# EAGLE design analog-out (EAGLE 9.6.2)
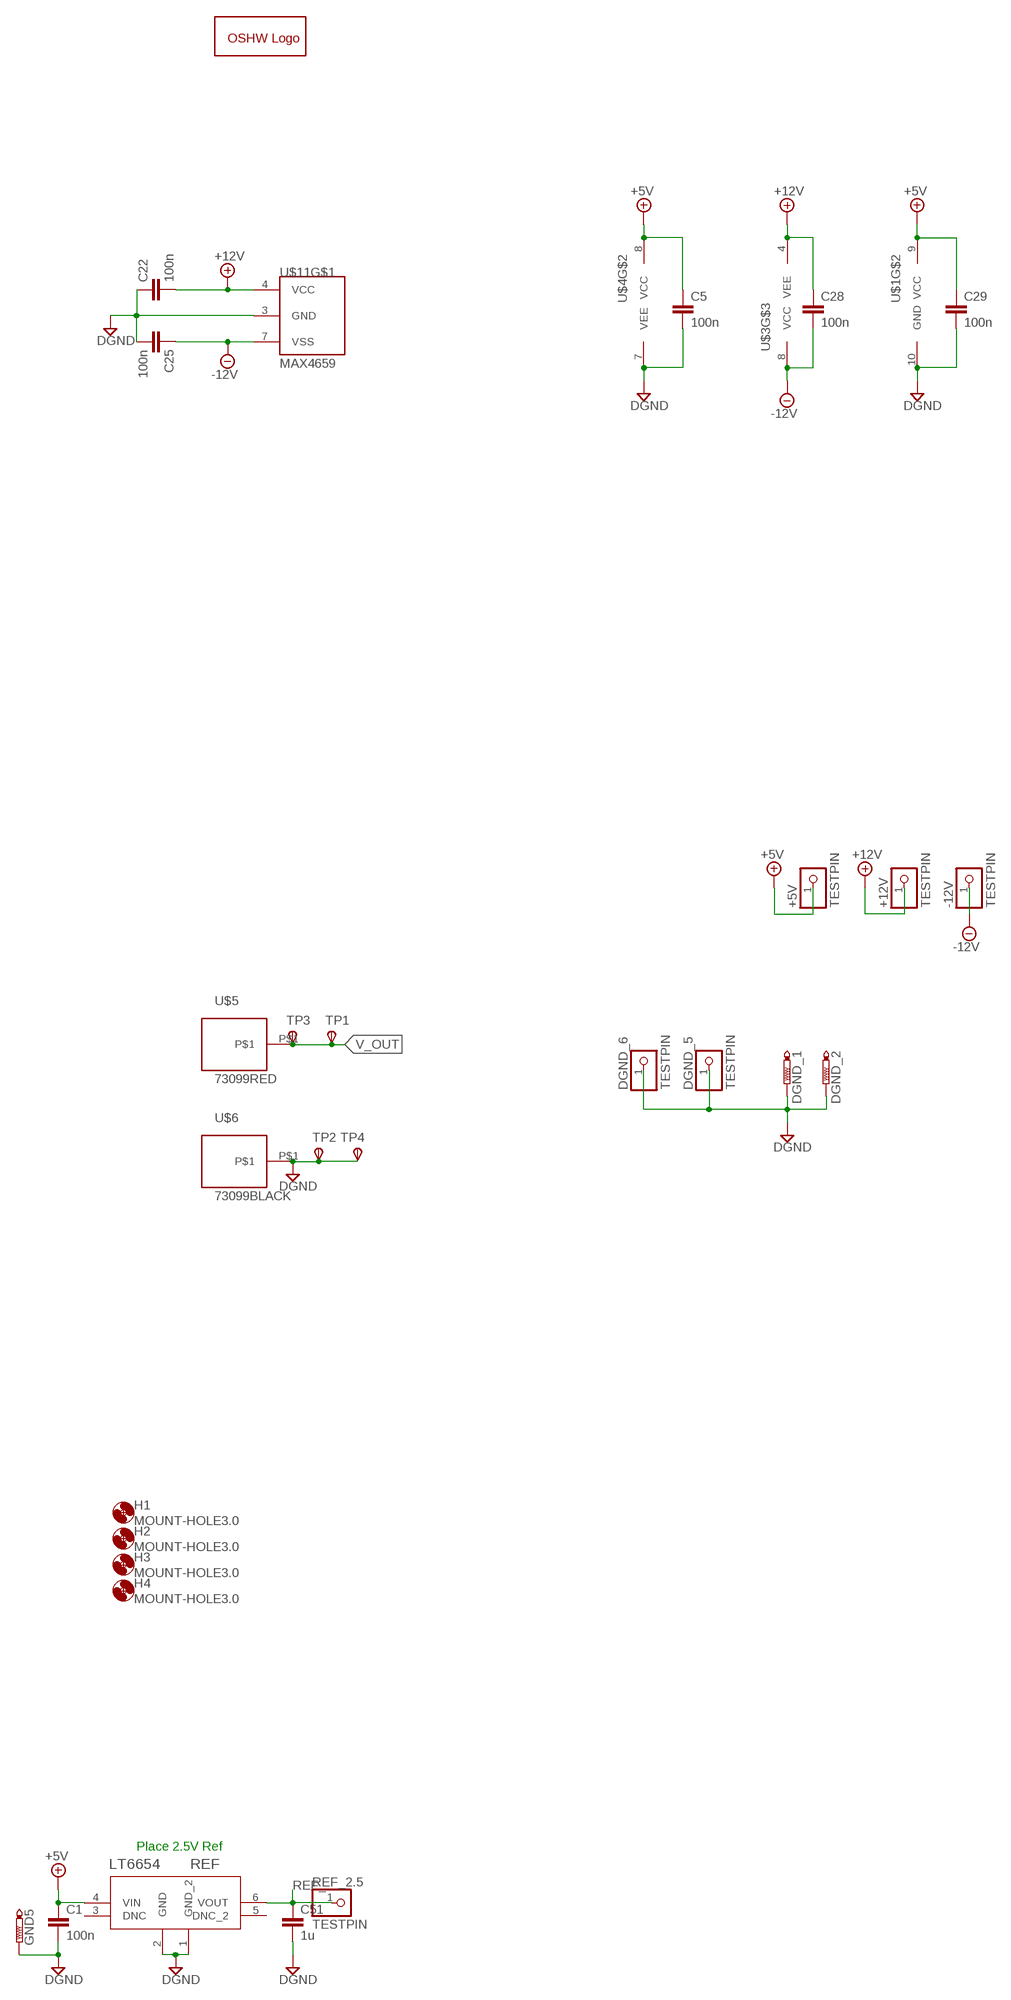
[diagram p0: schematic, sheet 1, part 1 of 2]
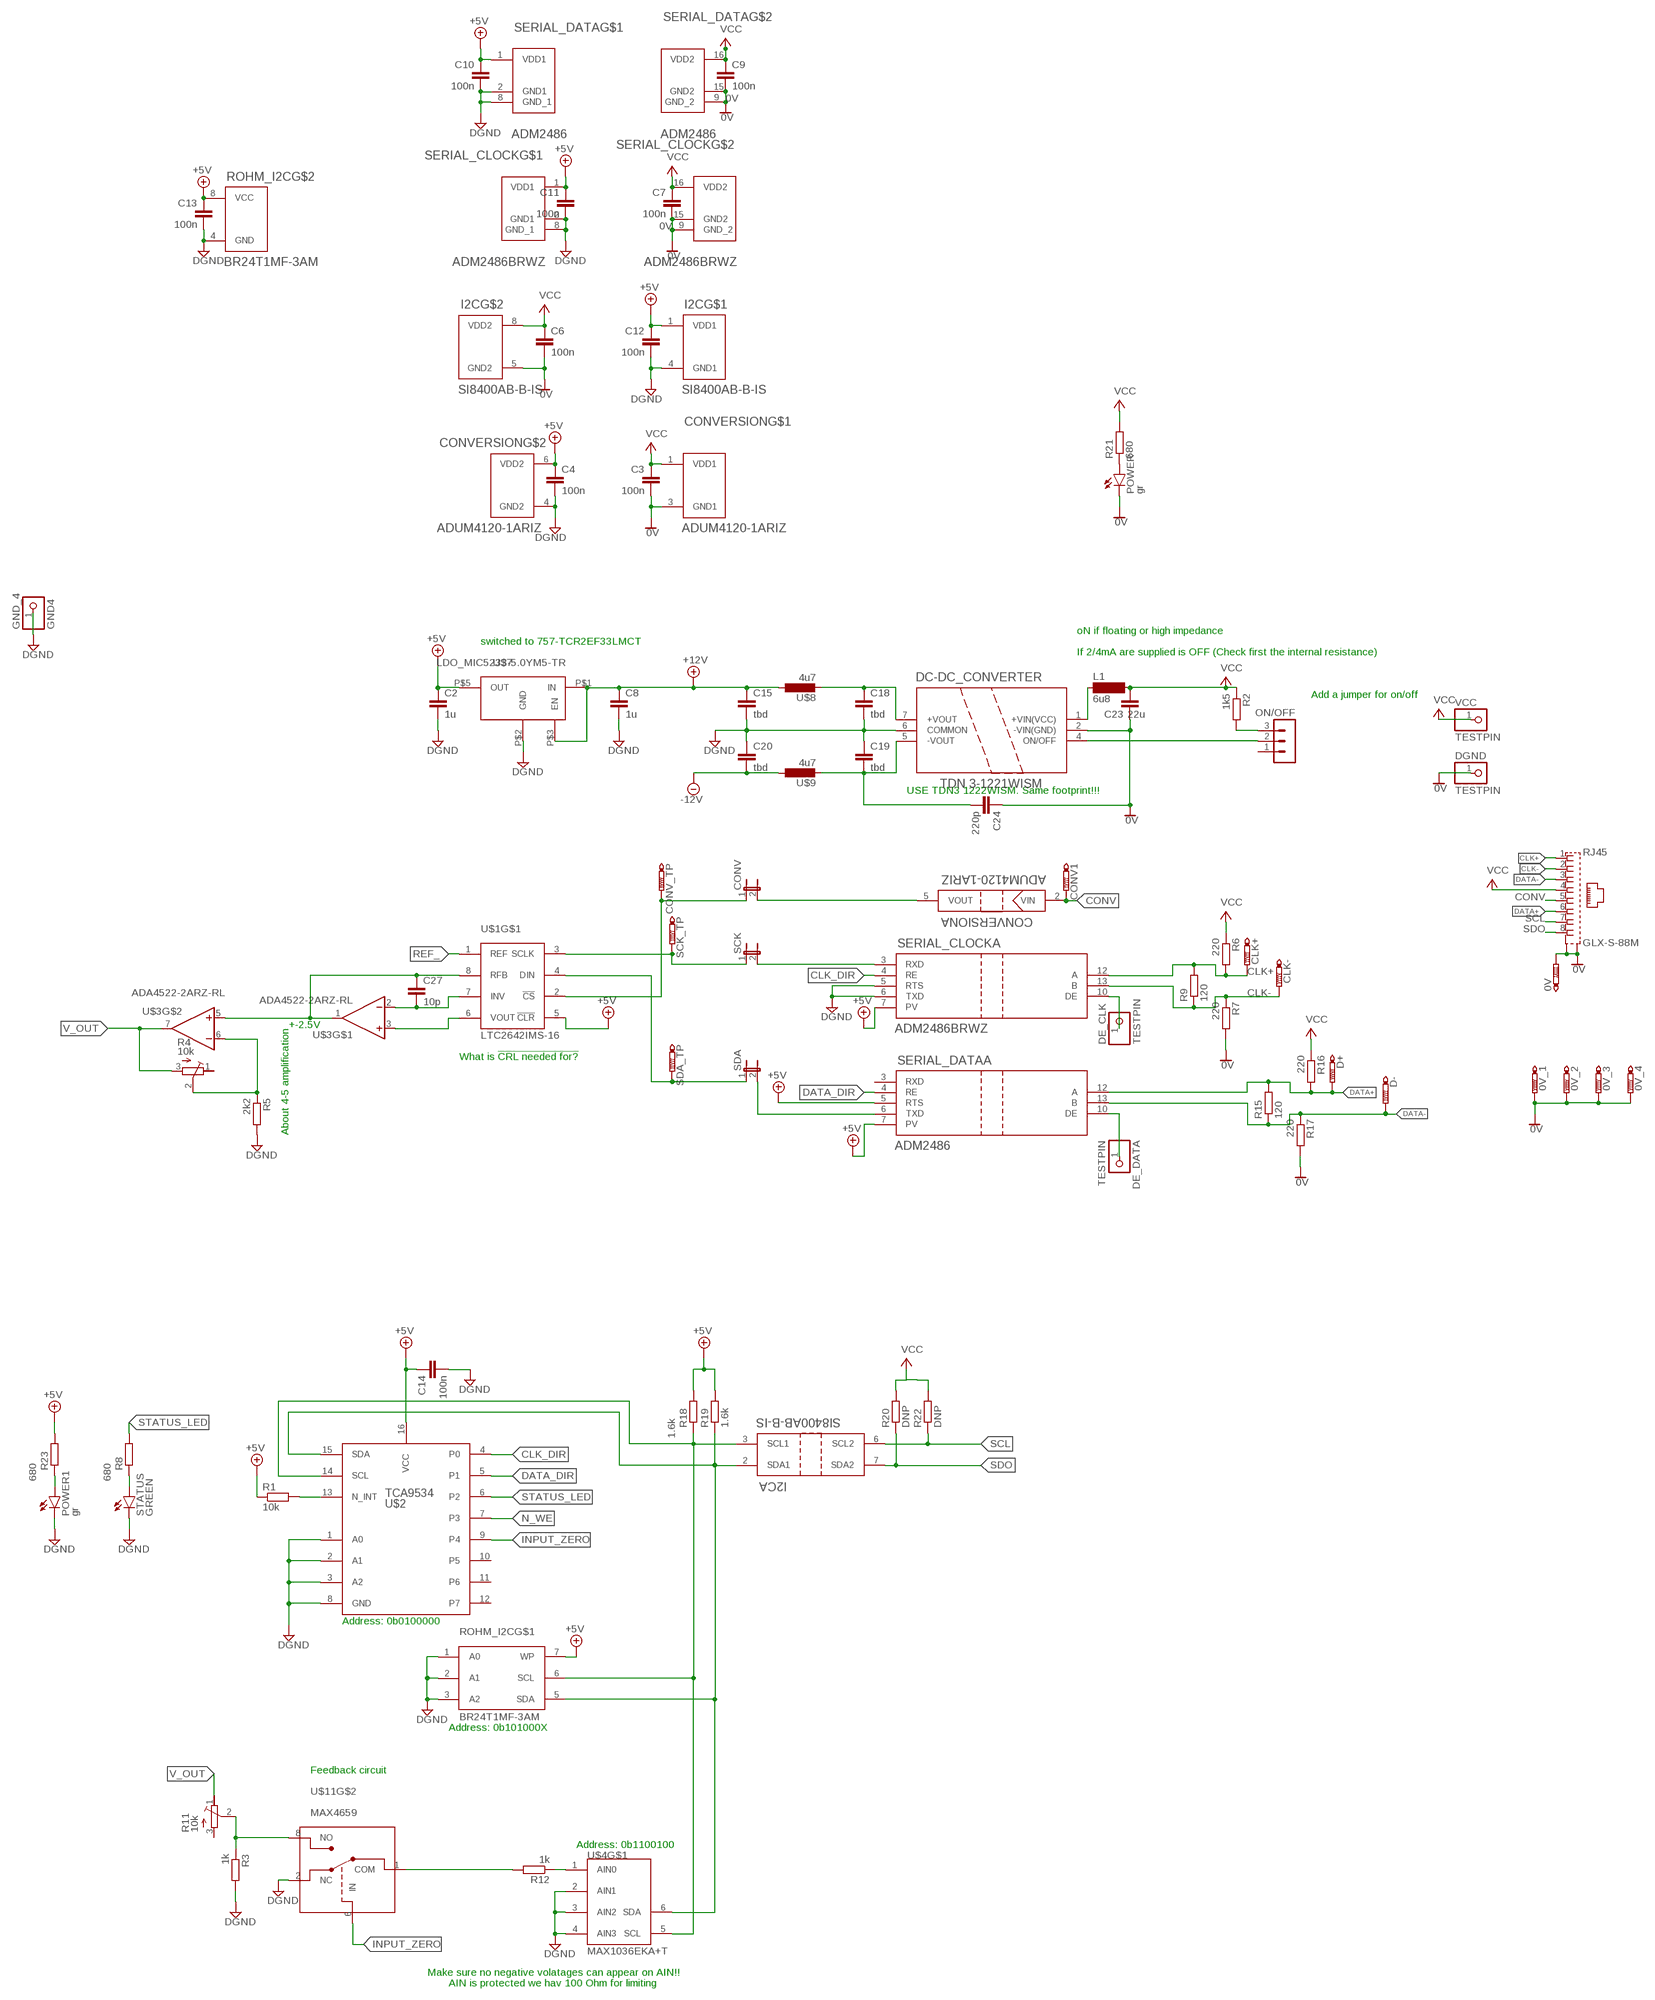
[diagram p1: schematic, sheet 1, part 2 of 2]

## Parts
0V  PTR1B1,27  [B1,27]
0V_1  PTR1B1,27  [B1,27]
0V_2  PTR1B1,27  [B1,27]
0V_3  PTR1B1,27  [B1,27]
0V_4  PTR1B1,27  [B1,27]
+5V  TESTPIN  [1X01]
+12V  TESTPIN  [1X01]
-12V  TESTPIN  [1X01]
C1  100n  C-EUC0805  [C0805]
C2  1u  C-EUC0805K  [C0805K]
C3  100n  C-EUC0805K  [C0805K]
C4  100n  C-EUC0805K  [C0805K]
C5  100n  C-EUC0805  [C0805]
C6  100n  C-EUC0805K  [C0805K]
C7  100n  C-EUC0805K  [C0805K]
C8  1u  C-EUC0805K  [C0805K]
C9  100n  C-EUC0805K  [C0805K]
C10  100n  C-EUC0805K  [C0805K]
C11  100n  C-EUC0805K  [C0805K]
C12  100n  C-EUC0805K  [C0805K]
C13  100n  C-EUC0805K  [C0805K]
C14  100n  C-EUC0805K  [C0805K]
C15  tbd  C-EUC0805K  [C0805K]
C18  tbd  C-EUC0805K  [C0805K]
C19  tbd  C-EUC0805K  [C0805K]
C20  tbd  C-EUC0805K  [C0805K]
C22  100n  C-EUC0805  [C0805]
C23  22u  C-EUC1206  [C1206]
C24  220p  C-EUC1808  [C1808]
C25  100n  C-EUC0805  [C0805]
C27  10p  C-EUC0805  [C0805]
C28  100n  C-EUC0805  [C0805]
C29  100n  C-EUC0805  [C0805]
C51  1u  C-EUC0805  [C0805]
CLK+  PTR1B1,27  [B1,27]
CLK-  PTR1B1,27  [B1,27]
CONV  JP1E  [JP1]
CONV1  PTR1B1,27  [B1,27]
CONV_TP  PTR1B1,27  [B1,27]
CONVERSION  ADUM4120-1ARIZ  [RI_6_1_ADI]
D+  PTR1B1,27  [B1,27]
D-  PTR1B1,27  [B1,27]
DC-DC_CONVERTER  TDN 3-1221WISM  TDN_3-1211WI  [TDN3_TRP]
DE_CLK  TESTPIN  [1X01]
DE_DATA  TESTPIN  [1X01]
DGND  TESTPIN  [1X01]
DGND_1  PTR1B1,27  [B1,27]
DGND_2  PTR1B1,27  [B1,27]
DGND_5  TESTPIN  [1X01]
DGND_6  TESTPIN  [1X01]
GND5  PTR1B1,27  [B1,27]
GND_4  GND4  TESTPIN  [1X01]
GOLD_ORB_SM1  OSHWLOGOLOGO8MM  [OSHW_8MM]
H1  MOUNT-HOLE3.0  [3,0]
H2  MOUNT-HOLE3.0  [3,0]
H3  MOUNT-HOLE3.0  [3,0]
H4  MOUNT-HOLE3.0  [3,0]
I2C  SI8400AB-B-IS  ADUM1251WARZ  [R_8_ADI]
L1  6u8  SM-NE29  [SM-NE29]
ON/OFF  MA03-1  [MA03-1]
POWER  gr  LEDSML0805  [SML0805]
POWER1  gr  LEDSML0805  [SML0805]
R1  10k  R-EU_R0805  [R0805]
R2  1k5  R-EU_R0805  [R0805]
R3  1k  R-EU_R0805  [R0805]
R4  10k  R-TRIMMT93YA  [RTRIMT93YA]
R5  2k2  R-EU_R0805  [R0805]
R6  220  R-EU_R0805  [R0805]
R7  220  R-EU_R0805  [R0805]
R8  680  R-EU_R0805  [R0805]
R9  120  R-EU_R0805  [R0805]
R11  10k  R-TRIMMT93YA  [RTRIMT93YA]
R12  1k  R-EU_R0805  [R0805]
R15  120  R-EU_R0805  [R0805]
R16  220  R-EU_R0805  [R0805]
R17  220  R-EU_R0805  [R0805]
R18  1.6k  R-EU_R0805  [R0805]
R19  1.6k  R-EU_R0805  [R0805]
R20  DNP  R-EU_R0805  [R0805]
R21  680  R-EU_R0805  [R0805]
R22  DNP  R-EU_R0805  [R0805]
R23  680  R-EU_R0805  [R0805]
REF  LT6654  LT6654AIS6-2.048TRMPBF  [S_6_ADI]
REF_2.5  TESTPIN  [1X01]
RJ45  GLX-S-88M  [GLX-S-88M]
ROHM_I2C  BR24T1MF-3AM  [BR24T1MFJ-3AM]
SCK  JP1E  [JP1]
SCK_TP  PTR1B1,27  [B1,27]
SDA  JP1E  [JP1]
SDA_TP  PTR1B1,27  [B1,27]
SERIAL_CLOCK  ADM2486BRWZ  ADM2486BRWZ-REEL  [RW_16_ADI]
SERIAL_DATA  ADM2486  ADM2486BRWZ-REEL  [RW_16_ADI]
STATUS  GREEN  LEDCHIPLED_0805  [CHIPLED_0805]
TP1  TPSTP20SQ  [TP20SQ]
TP2  TPSTP20SQ  [TP20SQ]
TP3  TPSTP20SQ  [TP20SQ]
TP4  TPSTP20SQ  [TP20SQ]
U$1  LTC2642IMS-16  [MSOP10]
U$2  TCA9534  [TSSOP16L]
U$3  ADA4522-2ARZ-RL  [MSOP8]
U$4  MAX1036EKA+T  [SOT23-8L]
U$5  73099RED  [4MM_BANANA]
U$6  73099BLACK  [4MM_BANANA]
U$7  LDO_MIC5233-5.0YM5-TR  [SOT23-5]
U$8  4u7  NRS5010T4R7MMGF  [L5038P]
U$9  4u7  NRS5010T4R7MMGF  [L5038P]
U$11  MAX4659  [UMAX8]
VCC  TESTPIN  [1X01]

## Nets
0V: 0V.TP 0V_1.TP 0V_2.TP 0V_3.TP 0V_4.TP C3.2 C6.2 C7.2 C9.2 C23.1 C24.1 CONVERSION.3(GND1) DC-DC_CONVERTER.2(-VIN(GND)) DGND.1 I2C.5(GND2) POWER.C R7.2 R17.2 RJ45.S1 RJ45.S2 SERIAL_CLOCK.9(GND_2) SERIAL_CLOCK.15(GND2) SERIAL_DATA.9(GND_2) SERIAL_DATA.15(GND2)
+5V: +5V.1 C1.1 C2.1 C4.1 C5.1 C10.1 C11.1 C12.1 C13.1 C14.1 C29.1 CONVERSION.6(VDD2) I2C.1(VDD1) R1.1 R18.2 R19.2 R23.2 REF.4(VIN) ROHM_I2C.7(WP) ROHM_I2C.8(VCC) SERIAL_CLOCK.1(VDD1) SERIAL_CLOCK.7(A:PV) SERIAL_DATA.1(VDD1) SERIAL_DATA.5(A:RTS) SERIAL_DATA.7(A:PV) U$1.5(!CLR) U$1.9(VCC) U$2.16(VCC) U$4.8(VCC) U$7.P$5(OUT)
+12V: +12V.1 C8.1 C15.1 C22.2 C28.1 U$3.4(VEE) U$7.P$1(IN) U$7.P$3(EN) U$8.1 U$11.4(VCC)
-12V: -12V.1 C20.2 C25.1 C28.2 U$3.8(VCC) U$9.1 U$11.7(VSS)
CLK+: CLK+.TP R6.2 R9.2 RJ45.1 SERIAL_CLOCK.12(A:A)
CLK-: CLK-.TP R7.1 R9.1 RJ45.2 SERIAL_CLOCK.13(A:B)
CLK_DIR: SERIAL_CLOCK.4(A:RE) U$2.4(P0)
CONV: CONV1.TP CONVERSION.2(A:VIN) RJ45.5
CONV_ADC: CONV.1 CONV_TP.TP U$1.2(!CS)
DATA+: D+.TP R15.2 R16.2 RJ45.6 SERIAL_DATA.12(A:A)
DATA-: D-.TP R15.1 R17.1 RJ45.3 SERIAL_DATA.13(A:B)
DATA_DIR: SERIAL_DATA.4(A:RE) U$2.5(P1)
DGND: C1.2 C2.2 C4.2 C5.2 C8.2 C10.2 C11.2 C12.2 C13.2 C14.2 C15.2 C18.2 C19.1 C20.1 C22.1 C25.2 C29.2 C51.2 CONVERSION.4(GND2) DC-DC_CONVERTER.6(COMMON) DGND_1.TP DGND_2.TP DGND_5.1 DGND_6.1 GND5.TP GND_4.1 I2C.4(GND1) POWER1.C R3.2 R5.2 REF.1(GND_2) REF.2(GND) ROHM_I2C.1(A0) ROHM_I2C.2(A1) ROHM_I2C.3(A2) ROHM_I2C.4(GND) SERIAL_CLOCK.2(GND1) SERIAL_CLOCK.5(A:RTS) SERIAL_CLOCK.6(A:TXD) SERIAL_CLOCK.8(GND_1) SERIAL_DATA.2(GND1) SERIAL_DATA.8(GND_1) STATUS.C TP2.TP(PP) TP4.TP(PP) U$1.10(GND) U$2.1(A0) U$2.2(A1) U$2.3(A2) U$2.8(GND) U$4.2(AIN1) U$4.3(AIN2) U$4.4(AIN3) U$4.7(VEE) U$6.P$1 U$7.P$2(GND) U$11.2(NC) U$11.3(GND)
INPUT_ZERO: U$2.9(P4) U$11.6(IN)
N$1: C27.2 U$1.7(INV) U$3.2(-IN)
N$2: R1.2 U$2.13(N_INT)
N$3: DE_CLK.1 SERIAL_CLOCK.10(A:DE)
N$4: SDA.2 SERIAL_DATA.6(A:TXD)
N$5: U$1.6(VOUT) U$3.3(+IN)
N$6: C19.2 C24.2 DC-DC_CONVERTER.5(-VOUT) U$9.2
N$7: DE_DATA.1 SERIAL_DATA.10(A:DE)
N$9: C27.1 U$1.8(RFB) U$3.1(OUT) U$3.5(+IN)
N$10: DC-DC_CONVERTER.1(+VIN(VCC)) L1.1
N$11: ON/OFF.3 R2.2
N$12: DC-DC_CONVERTER.4(ON/OFF) ON/OFF.2
N$13: R12.1 U$4.1(AIN0)
N$14: I2C.2(A:SDA1) R19.1 ROHM_I2C.5(SDA) U$2.15(SDA) U$4.6(SDA)
N$15: R4.2(S) R5.1 U$3.6(-IN)
N$16: R3.1 R11.2(S) U$11.8(NO)
N$17: I2C.3(A:SCL1) R18.1 ROHM_I2C.6(SCL) U$2.14(SCL) U$4.5(SCL)
N$18: R12.2 U$11.1(COM)
N$19: C18.1 DC-DC_CONVERTER.7(+VOUT) U$8.2
N$22: R8.1 STATUS.A
N$24: CONV.2 CONVERSION.5(A:VOUT)
N$26: SCK.1 SCK_TP.TP U$1.3(SCLK)
N$27: POWER1.A R23.1
N$53: POWER.A R21.1
N_WE: U$2.7(P3)
REF_: C51.1 REF.6(VOUT) REF_2.5.1 U$1.1(REF)
SCK_ADC: SCK.2 SERIAL_CLOCK.3(A:RXD)
SCL: I2C.6(A:SCL2) R22.1 RJ45.7
SDO: I2C.7(A:SDA2) R20.1 RJ45.8
SDO_ADC: SDA.1 SDA_TP.TP U$1.4(DIN)
STATUS_LED: R8.2 U$2.6(P2)
V+: C3.1 C6.1 C7.1 C9.1 C23.2 CONVERSION.1(VDD1) I2C.8(VDD2) L1.2 R2.1 R6.1 R16.1 R20.2 R21.2 R22.2 RJ45.4 SERIAL_CLOCK.16(VDD2) SERIAL_DATA.16(VDD2) VCC.1 ; supply symbol labelled VCC
V_OUT: R4.3(A) R11.1(E) TP1.TP(PP) TP3.TP(PP) U$3.7(OUT) U$5.P$1
Unconnected: ON/OFF.1 R4.1(E) R11.3(A) REF.3(DNC) REF.5(DNC_2) SERIAL_DATA.3(A:RXD) U$2.10(P5) U$2.11(P6) U$2.12(P7)

## Notes on the sheet
- oN if floating or high impedance
- switched to 757-TCR2EF33LMCT
- If 2/4mA are supplied is OFF (Check first the internal resistance)
- Add a jumper for on/off
- USE TDN3 1222WISM. Same footprint!!!
- +-2.5V
- What is !CRL needed for?
- About 4-5 amplification
- Place 2.5V Ref
- Address: 0b0100000
- Address: 0b101000X
- Feedback circuit
- Address: 0b1100100
- Make sure no negative volatages can appear on AIN!!
- AIN is protected we hav 100 Ohm for limiting

## Library data of the parts
0V 0V_1-0V_4 CLK+ CLK- CONV1 CONV_TP D+ D- DGND_1 DGND_2 GND5 SCK_TP SDA_TP = testpad:PTR1: TEST PIN
+5V +12V -12V DE_CLK DE_DATA DGND DGND_5 DGND_6 GND_4 REF_2.5 VCC = myLib:TESTPIN
C1 C5 C22 C25 C27-C29 = rcl:C-EU: CAPACITOR, European symbol; DIGIKEY: 478-7962-1-ND; MOUSER: 81-GRM21BZ71E106KE5L; SPICEPREFIX: C
C2-C4 C6-C15 C18-C20 = rcl:C-EU: CAPACITOR, European symbol; DIGIKEY: 478-7962-1-ND; SPICEPREFIX: C
C23 = rcl:C-EU: CAPACITOR, European symbol; DIGIKEY: 399-17625-1-ND; SPICEPREFIX: C
C24 = rcl:C-EU: CAPACITOR, European symbol; DIGIKEY: 478-10448-2-ND; SPICEPREFIX: C
C51 = rcl:C-EU: CAPACITOR, European symbol; DIGIKEY: 1276-6471-1-ND; MOUSER: 81-GRM21BZ71E106KE5L; SPICEPREFIX: C
CONV SCK SDA = jumper:JP1E: JUMPER
CONVERSION = ADUM4120:ADUM4120-1ARIZ; BUILT_BY: Analog Devices Inc.; DIGIKEY: ADUM4120-1ARIZ-ND; MANUFACTURER_PART_NUMBER: ADUM4120-1ARIZ; SOURCELIBRARY: Analog_2017-10-24; VENDOR: Analog Devices Inc
DC-DC_CONVERTER = TDN3-1221WISM:TDN_3-1211WI; BUILT_BY: EMA_Justin; COPYRIGHT: Copyright (C) 2018 Accelerated Designs. All rights reserved; DIGIKEY: TDN3-1222WISM-ND; MOUSER: 495-TDN3-1222WISM; SOURCELIBRARY: Traco_Power_2020-05-19; VENDOR: Traco Power
GOLD_ORB_SM1 = oshw:OSHWLOGO: The OSHW logo for PCB layout
H1-H4 = holes:MOUNT-HOLE: MOUNTING HOLE with drill center marker
I2C = ADUM1251WARZ:ADUM1251WARZ; BUILT_BY: EMA_UL_Team; COPYRIGHT: Copyright (C) 2018 Accelerated Designs. All rights reserved; MANUFACTURER_PART_NUMBER: ADUM1251WARZ; MOUSER: 634-SI8400AB-B-IS; SOURCELIBRARY: Analog_2019-03-08; VENDOR: Analog Devices Inc
L1 = inductor-neosid:SM-NE29: INDUCTOR SMD chip inductor; DIGIKEY: 1951-1045-ND; OC_FARNELL: unknown; OC_NEWARK: unknown
ON/OFF = con-lstb:MA03-1: PIN HEADER; DIGIKEY: 732-5316-ND; OC_FARNELL: unknown; OC_NEWARK: unknown
POWER POWER1 STATUS = led:LED: LED OSRAM: - CHIPLED LG R971, LG N971, LY N971, LG Q971, LY Q971, LO R971, LY R971 LH N974, LH R974 LS Q976, LO Q976, LY Q976 LO Q996 - Hyper CHIPLED LW Q18S LB Q993, LB Q99A, LB R99A - SideLED LS A670, LO A670, LY A670, LG A670, LP A670 LB A673, LV A673, LT A673, LW A673 LH A674 LY A675 LS A676, LA A676, LO A676, LY A676, LW A676 LS A679, LY A679, LG A679 - Hyper Micro SIDELED® LS Y876, LA Y876, LO Y876, LY Y876 LT Y87S - SmartLED LW L88C, LW L88S LB L89C, LB L89S, LG L890 LS L89K, LO L89K, LY L89K LS L896, LA L896, LO L896, LY L896 - TOPLED LS T670, LO T670, LY T670, LG T670, LP T670 LSG T670, LSP T670, LSY T670, LOP T670, LYG T670 LG T671, LOG T671, LSG T671 LB T673, LV T673, LT T673, LW T673 LH T674 LS T676, LA T676, LO T676, LY T676, LB T676, LH T676, LSB T676, LW T676 LB T67C, LV T67C, LT T67C, LS T67K, LO T67K, LY T67K, LW E67C LS E67B, LA E67B, LO E67B, LY E67B, LB E67C, LV E67C, LT E67C LW T67C LS T679, LY T679, LG T679 LS T770, LO T770, LY T770, LG T770, LP T770 LB T773, LV T773, LT T773, LW T773 LH T774 LS E675, LA E675, LY E675, LS T675 LS T776, LA T776, LO T776, LY T776, LB T776 LHGB T686 LT T68C, LB T68C - Hyper Mini TOPLED® LB M676 - Mini TOPLED Santana® LG M470 LS M47K, LO M47K, LY M47K Source: http://www.osram.convergy.de LUXEON: - LUMILED® LXK2-PW12-R00, LXK2-PW12-S00, LXK2-PW14-U00, LXK2-PW14-V00 LXK2-PM12-R00, LXK2-PM12-S00, LXK2-PM14-U00 LXK2-PE12-Q00, LXK2-PE12-R00, LXK2-PE12-S00, LXK2-PE14-T00, LXK2-PE14-U00 LXK2-PB12-K00, LXK2-PB12-L00, LXK2-PB12-M00, LXK2-PB14-N00, LXK2-PB14-P00, LXK2-PB14-Q00 LXK2-PR12-L00, LXK2-PR12-M00, LXK2-PR14-Q00, LXK2-PR14-R00 LXK2-PD12-Q00, LXK2-PD12-R00, LXK2-PD12-S00 LXK2-PH12-R00, LXK2-PH12-S00 LXK2-PL12-P00, LXK2-PL12-Q00, LXK2-PL12-R00 Source: www.luxeon.com KINGBRIGHT: KA-3528ASYC Source: www.kingbright.com; DIGIKEY: LTST-C170GKT
R1 = rcl:R-EU_: RESISTOR, European symbol; DIGIKEY: P10KDATR-ND; MOUSER: 652-CR0805JW-561ELF; SPICEPREFIX: R
R2 = rcl:R-EU_: RESISTOR, European symbol; DIGIKEY: P1.5KDATR-ND; SPICEPREFIX: R
R3 R5 R9 R15 = rcl:R-EU_: RESISTOR, European symbol; DIGIKEY: Y1629-120DTR-ND; SPICEPREFIX: R
R4 R11 = rcl:R-TRIMM: Trimm resistor; SPICEMODEL: X; SPICEPREFIXL: POT
R6 R7 R16 R17 = rcl:R-EU_: RESISTOR, European symbol; DIGIKEY: Y1624195R000Q9R-ND; SPICEPREFIX: R
R8 R12 R18-R20 R22 R23 = resistor:R-EU_: RESISTOR, European symbol
R21 = rcl:R-EU_: RESISTOR, European symbol; DIGIKEY: A129747TR-ND; MOUSER: 652-CR0805JW-561ELF; SPICEPREFIX: R
REF = LT6654AIS6-2.048:LT6654AIS6-2.048TRMPBF; BUILT_BY: EMA_Jessica; COPYRIGHT: Copyright (C) 2016 Accelerated Designs. All rights reserved; DIGIKEY: 505-LT6654AIS6-2.5#TRMPBFTR-ND; SOURCELIBRARY: Analog_Devices_2018-09-28; VENDOR: Analog Devices Inc
RJ45 = con-kycon:GLX-S-88M: Mod. Jack, Right Angle, 8 posiotion, 8 contatcs RJ45 Source: GLX-S-88M.pdf; DIGIKEY: 2092-GLX-S-88M-ND; OC_FARNELL: unknown; OC_NEWARK: unknown
ROHM_I2C = BR24T1MFJ-3AM:BR24T1MF-3AM; DIGIKEY: BR24T1MF-3AME2TR-ND
SERIAL_CLOCK SERIAL_DATA = ADM2486:ADM2486BRWZ-REEL; BUILT_BY: EMA_UL_Team; DIGIKEY: ADM2486BRWZ-REELTR-ND; MANUFACTURER_PART_NUMBER: ADM2486BRWZ-REEL; SOURCELIBRARY: Analog_2012-01-01_7; VENDOR: Analog Devices Inc
TP1-TP4 = CONN_smd:TPS: TEST PIN
U$1 = my:LTC2642IMS-16; DIGIKEY: LTC2642IMS-16#TRPBFCT-ND
U$2 = parts:TCA9534; DIGIKEY: 296-40574-2-ND
U$3 = my:ADA4522-2ARZ-RL; DIGIKEY: 505-ADA4522-2ARZ-RLCT-ND
U$4 = my:MAX1036EKA+T; DIGIKEY: MAX1036EKA+TTR-ND
U$5 U$6 = my:73099
U$7 = my:LDO_; MOUSER: 998-MIC5233-5.0YM5TR
U$8 U$9 = my:NRS5010T4R7MMGF
U$11 = my:MAX4659; MOUSER: 700-MAX4659EUA

## Net classes
3 FPGA: clearance 0.152 mm to class 0, clearance 7.112 mm to class 1, clearance 3.785 mm to class 2, clearance 0.152 mm

## Board
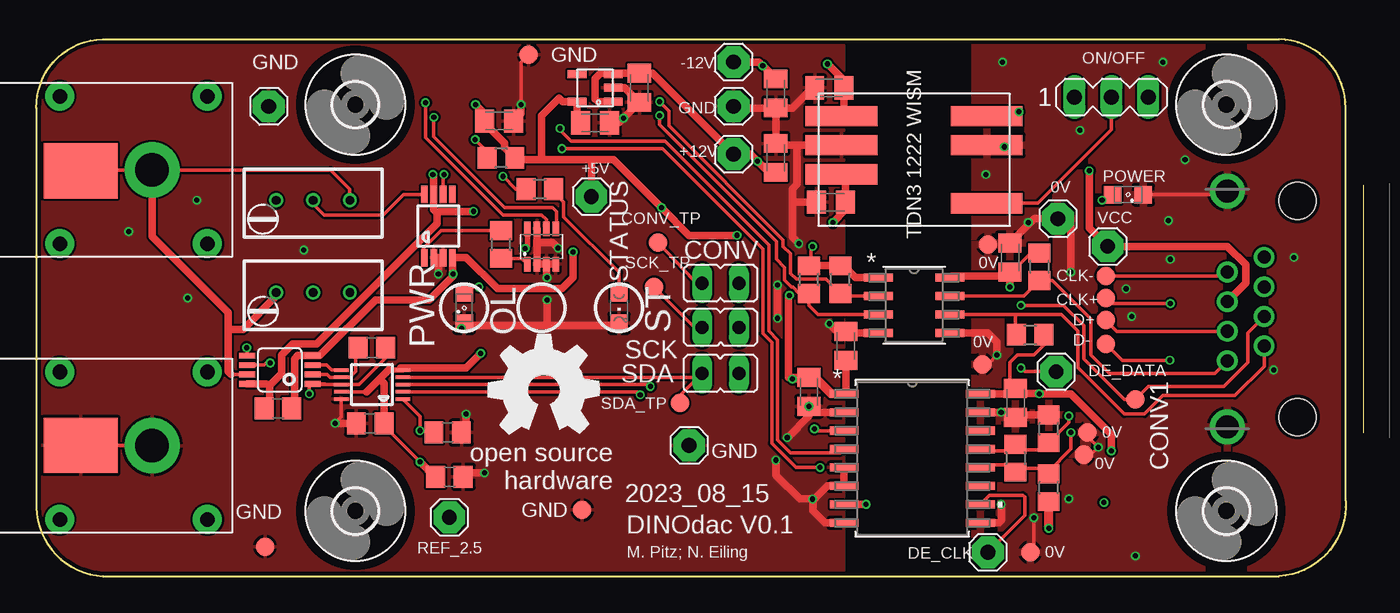
[diagram p2: board, top side]
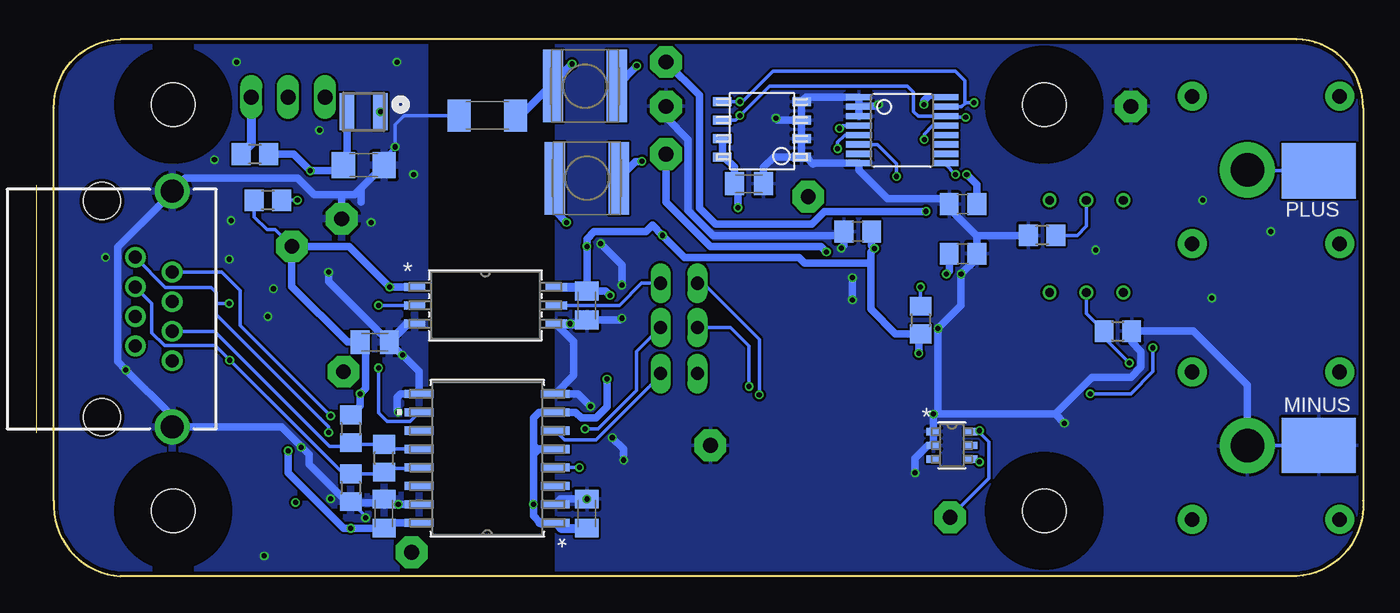
[diagram p3: board, bottom side, seen from below]

Size 90.19 x 37 mm. Coordinates in mm from the lower left corner, seen from the top.
Outline: 0.01,32.26 arc-90 4.58,37 85.61,37 arc-90 90.18,32.26 90.18,5.21 arc-90 85.61,0 4.58,0 arc-90 0.01,5.21 0.01,32.26
Copper layers (1*16): Top 0.018mm / dielectric 1.55mm / Bottom 0.018mm
Design rules "eC_2Layer_PClass6_BaseCopperO18_eCDefault": minimum track width 0.15mm, minimum drill 0.35mm, track to track 0.15mm, track to pad 0.15mm, pad to pad 0.15mm, via to via 0.15mm, smd to smd 0mil, copper to edge 0.25mm, drill to drill 0.35mm, minimum pad ring 0.175mm, minimum via ring 0.125mm, stop-mask expansion 0mil, vias tented up to drill 0.45mm, thermal gap 0.2mm

### Footprints (pad centres in the part's own frame; a part is rotated, then mirrored left to right if it is on the bottom)
B1,27 = smd 1.27 x 1.27: TP 0,0
1X01 = drill 1.016 pad 2.184 octagon: 1 0,0
C0805 = smd 1.3 x 1.5: 1 -0.95,0; 2 0.95,0
C0805K = smd 1.3 x 1.6: 1 -1,0; 2 1,0
C1206 = smd 1.6 x 1.8: 1 -1.4,0; 2 1.4,0
C1808 = smd 1.6 x 2.2: 1 -1.95,0; 2 1.95,0
JP1 = drill 0.914 long: 1 0,-1.27; 2 0,1.27
RI_6_1_ADI = smd 1.461 x 0.561: 1 -4.88,1.27; 2 -4.88,0; 3 -4.88,-1.27; 4 4.88,-1.27; 5 4.88,0; 6 4.88,1.27
TDN3_TRP = smd 4.95 x 1.397: 1 -5,-3; 2 -5,-1; 4 -5,3; 5 5,-3; 6 5,-1; 7 5,1
3,0 = hole 3: 0,0
R_8_ADI = smd 1.981 x 0.559: 1 -2.464,1.905; 2 -2.464,0.635; 3 -2.464,-0.635; 4 -2.464,-1.905; 5 2.464,-1.905; 6 2.464,-0.635; 7 2.464,0.635; 8 2.464,1.905
SM-NE29 = smd 1 x 2.54: 1 -1.15,0; 2 1.15,0
MA03-1 = drill 1.016 long: 1 -2.54,0; 2 0,0; 3 2.54,0
SML0805 = smd 1.2 x 1.2: A 1.05,0; C -1.05,0
R0805 = smd 1.3 x 1.5: 1 -0.95,0; 2 0.95,0
RTRIMT93YA = drill 0.61: 1 0,-2.54; 2 0,0; 3 0,2.54
S_6_ADI = smd 0.94 x 0.508: 1 -1.283,0.95; 2 -1.283,0; 3 -1.283,-0.95; 4 1.283,-0.95; 5 1.283,0; 6 1.283,0.95
GLX-S-88M = drill 0.9 pad 1.422: 1 -3.57,-2.3; 2 -2.55,-4.84; 3 -1.53,-2.3; 4 -0.51,-4.84; 5 0.51,-2.3; 6 1.53,-4.84; 7 2.55,-2.3; 8 3.57,-4.84 | drill 1.6 pad 2.184: S1 -8.125,-4.84; S2 8.125,-4.84 | hole 2.55: -7.44,0; 7.44,0
BR24T1MFJ-3AM = smd 0.635 x 1.27: 1 -1.714,-2.731; 2 -0.445,-2.731; 3 0.826,-2.731; 4 2.095,-2.731; 5 2.095,2.731; 6 0.826,2.731; 7 -0.445,2.731; 8 -1.714,2.731
RW_16_ADI = smd 1.981 x 0.559: 1 -4.686,4.445; 2 -4.686,3.175; 3 -4.686,1.905; 4 -4.686,0.635; 5 -4.686,-0.635; 6 -4.686,-1.905; 7 -4.686,-3.175; 8 -4.686,-4.445; 9 4.686,-4.445; 10 4.686,-3.175; 11 4.686,-1.905; 12 4.686,-0.635; 13 4.686,0.635; 14 4.686,1.905; 15 4.686,3.175; 16 4.686,4.445
CHIPLED_0805 = smd 1.2 x 1.2: A 0,-1.05; C 0,1.05
TP20SQ = smd 5.08 x 3.81: TP 0,0
MSOP10 = smd 0.25 x 1: 1 -1,-2.113; 2 -0.5,-2.113; 3 0,-2.113; 4 0.5,-2.113; 5 1,-2.113; 6 1,2.113; 7 0.5,2.113; 8 0,2.113; 9 -0.5,2.113; 10 -1,2.113
TSSOP16L = smd 0.42 x 1.78: 1 -2.275,-2.97; 2 -1.625,-2.97; 3 -0.975,-2.97; 4 -0.325,-2.97; 5 0.325,-2.97; 6 0.975,-2.97; 7 1.625,-2.97; 8 2.275,-2.97; 9 2.275,2.97; 10 1.625,2.97; 11 0.975,2.97; 12 0.325,2.97; 13 -0.325,2.97; 14 -0.975,2.97; 15 -1.625,2.97; 16 -2.275,2.97
MSOP8 = smd 0.4 x 1.1: 1 -0.975,-2.25; 2 -0.325,-2.25; 3 0.325,-2.25; 4 0.975,-2.25; 5 0.975,2.25; 6 0.325,2.25; 7 -0.325,2.25; 8 -0.975,2.25
SOT23-8L = smd 0.45 x 1: 1 -0.975,-1.225; 2 -0.325,-1.225; 3 0.325,-1.225; 4 0.975,-1.225; 5 0.975,1.225; 6 0.325,1.225; 7 -0.325,1.225; 8 -0.975,1.225
4MM_BANANA = drill 2.3 pad 3.8: P$1 0,0 | drill 1 pad 2: P$2 -3.8,5.08; P$3 6.36,5.08; P$4 6.36,-5.08; P$5 -3.8,-5.08
SOT23-5 = smd 1.3 x 0.55: P$1 -1.25,0.95; P$2 -1.25,0; P$3 -1.25,-0.95; P$4 1.25,-0.95; P$5 1.25,0.95
L5038P = smd 1.4 x 5: 1 -2.2,0; 2 2.2,0
UMAX8 = smd 0.45 x 1.2: 1 -0.975,-2.175; 2 -0.325,-2.175; 3 0.325,-2.175; 4 0.975,-2.175; 5 0.975,2.175; 6 0.325,2.175; 7 -0.325,2.175; 8 -0.975,2.175

### Placement (x,y rotation side)
0V  68.46,1.65 90 top
0V_1  65.54,22.86 0 top
0V_2  65.16,14.61 0 top
0V_3  72.14,8.38 0 top
0V_4  72.4,9.91 0 top
+5V  38.24,26.16 0 top
+12V  48.01,29.08 0 top
-12V  48.01,35.43 0 top
C1  28.46,6.86 0 top
C2  38.49,31.24 0 top
C3  68.08,16.13 0 bottom
C4  53.48,18.67 270 bottom
C5  34.81,23.75 180 bottom
C6  67.06,21.97 90 top
C7  67.45,11.94 270 top
C8  41.54,33.66 270 top
C9  67.45,4.32 90 bottom
C10  53.48,4.32 90 bottom
C11  53.22,12.7 270 top
C12  55.76,15.88 90 top
C13  42.3,27.05 0 bottom
C14  31.89,31.37 0 top
C15  50.94,28.83 90 top
C18  54.75,25.78 180 top
C19  54.62,33.66 0 top
C20  50.94,33.27 90 top
C22  27.57,22.23 180 bottom
C23  68.84,28.32 180 bottom
C24  60.33,31.75 0 bottom
C25  27.57,25.65 180 bottom
C27  23.12,15.75 180 top
C28  16.65,11.56 180 top
C29  23,10.54 180 top
C51  28.33,9.91 0 top
CLK+  73.67,19.18 0 top
CLK-  73.67,20.7 0 top
CONV  47.13,20.19 270 top
CONV1  75.7,12.19 270 top
CONV_TP  42.81,22.99 270 top
CONVERSION  60.46,18.67 0 bottom
D+  73.67,17.65 0 top
D-  73.67,16 0 top
DC-DC_CONVERTER  60.46,28.7 180 top
DE_CLK  65.54,1.65 0 top
DE_DATA  70.24,14.1 0 top
DGND  70.37,24.64 0 top
DGND_1  37.6,4.57 180 top
DGND_2  15.76,2.03 0 top
DGND_5  44.97,9.02 0 top
DGND_6  16.01,32.38 0 top
GND5  33.92,35.94 0 top
GND_4  48.01,32.38 0 top
GOLD_ORB_SM1  34.93,12.83 0 top
H1  81.98,32.5 0 top
H2  81.98,4.5 0 top
H3  21.98,32.5 0 top
H4  21.98,4.5 0 top
I2C  60.46,18.67 0 top
L1  68.84,32 180 bottom
ON/OFF  74.05,33.02 0 top
POWER  75.19,26.29 180 top
POWER1  29.47,18.5 90 top
R1  32.01,28.83 180 top
R2  76.34,29.08 180 bottom
R3  22.11,23.5 180 bottom
R4  19.06,19.56 90 top
R5  16.9,16.89 0 bottom
R6  69.73,6.1 90 top
R7  69.73,10.16 90 top
R8  34.68,26.67 180 top
R9  67.45,8.13 270 top
R11  19.06,25.91 90 top
R12  32.01,22.86 90 top
R15  67.45,8.13 90 bottom
R16  69.73,10.16 270 bottom
R17  69.73,6.1 270 bottom
R18  53.22,20.45 90 top
R19  55.38,20.45 90 top
R20  69.1,21.34 90 top
R21  75.45,25.91 180 bottom
R22  68.46,16.64 0 top
R23  30.49,17.65 270 bottom
REF  28.33,9.02 0 bottom
REF_2.5  28.46,4.06 180 top
RJ45  86.88,18.41 270 top
ROHM_I2C  41.41,30.61 90 bottom
SCK  47.13,17.14 270 top
SCK_TP  42.55,19.94 270 top
SDA  47.13,13.97 270 top
SDA_TP  44.33,11.94 0 top
SERIAL_CLOCK  60.33,8.13 0 top
SERIAL_DATA  60.33,8.13 180 bottom
STATUS  40.14,18.5 180 top
TP1  3.06,27.94 0 bottom
TP2  3.06,9.02 0 top
TP3  3.06,27.94 0 top
TP4  3.06,9.02 0 bottom
U$1  23.12,13.21 90 top
U$2  31.76,30.73 270 bottom
U$3  16.77,14.22 90 top
U$4  34.81,22.73 0 top
U$5  7.98,28 180 top
U$6  7.98,9 180 top
U$7  38.49,33.66 180 top
U$8  53.48,27.43 180 bottom
U$9  53.6,33.78 180 bottom
U$11  27.69,24.13 0 top
VCC  73.8,22.73 0 top

### Tracks (layer width: path | path; a pad name or v marks a point on that pad's centre or on a via)
0V  (via drill 0.35)
  Top 0.254: DC-DC_CONVERTER.2 66.24,30.04 v66.68,29.59 | POWER.C 81.79,26.29 RJ45.S1 | 0V.TP 68.72,1.91 v68.72,4.02 | 0V_1.TP 65.29,22.61 | 0V_2.TP 65.54,14.61 v66.18,15.24 | 0V_3.TP 72.65,8.38 v73.16,8.89 72.4,9.65 0V_4.TP
  Top 0.508: R7.2 67.62,11.11 | SERIAL_CLOCK.15 v66.46,11.3 67.42,11.3 | v66.46,4.95 66.46,3.84 66.3,3.68 SERIAL_CLOCK.9 | v71.26,20.95 71.26,24.64 DGND.1 68.73,24.64 C6.2 | I2C.5 65.54,16.76 66.18,16.13 v66.18,15.24
  Top 0.635: C7.2 67.62,11.11 67.42,11.3
  Bottom 0.254: C24.1 66.05,31.75 66.68,31.11 v66.68,29.59 67.44,28.83 C23.1 | 70.49,26.29 70.37,26.16 | v68.72,4.02 68.72,4.13 69.65,5.06 | C3.2 67.12,16.13 67.15,16.09
  Bottom 0.508: 67.42,4.95 v66.46,4.95 SERIAL_DATA.15 | 69.65,5.06 67.7,5.06 | 70.37,26.16 DGND.1 | R17.2 70.05,5.15 72.62,7.71 72.62,8.41 74.49,10.29 RJ45.S2 82.04,11.04 v85.23,14.22 85.8,14.8 85.8,22.67 82.04,26.43 RJ45.S1 81.15,27.43 73.41,27.43 72.27,26.29 70.49,26.29 69.47,26.29 69.03,26.73 | v71.26,20.95 71.26,20.32 67.08,16.15 C3.2 66.19,15.24 v66.18,15.24 66.16,15.24 65.02,14.1 SERIAL_DATA.9 66.3,12.57 66.56,12.32 66.56,11.4 v66.46,11.3 | C23.1 69.03,26.73 | 69.03,26.73 69.03,25.79
  Bottom 0.635: 67.42,4.95 67.62,5.15 C9.2 67.7,5.06 | R17.2 69.65,5.06 | CONVERSION.3 65.85,17.4 67.15,16.09
  other vias: 75.07,19.81 78.11,21.84 71.13,5.33 75.7,1.4 86.62,21.97 66.56,35.43 65.41,27.69 77.61,35.43 79.13,28.7 71.89,30.73 77.99,24.51 68.33,24.38 75.45,17.91
  pour Top: 64.65,39.24 93.23,39.24 93.23,-1.27 65.16,-1.27 64.65,-0.76
  pour Bottom: 64.65,39.24 93.23,39.24 93.23,-1.27 65.16,-1.27 64.65,-0.76
+5V  (via drill 0.35)
  Top 0.254: C1.1 27.44,6.86 | C11.1 53.11,13.59 | 55.58,21.4 R19.2 | R18.2 53.35,21.52 53.35,22.61 v53.48,22.73 | U$1.9 22.75,12.71 | 25.09,14.35 25.22,14.22 U$1.5 | v26.42,7.87 23.95,10.35 C29.1 | 33.83,22.76 v33.66,22.59
  Top 0.381: 24.27,14.22 25.22,14.22 | U$4.8 33.83,22.76
  Top 0.508: SERIAL_CLOCK.7 v57.16,4.95 | 27.44,6.86 v26.42,7.87 | 34.81,28.7 33.09,28.7 R1.1 32.27,29.52 32.27,29.84 30.89,31.23 C14.1 30.89,31.88 v30.25,32.51 | 34.81,28.7 38.24,28.7 | 38.24,28.7 39.76,28.7 v43.06,25.4 44.97,23.5 v48.27,23.5 | 53.11,13.59 v52.08,13.59 | v51.88,19.36 51.82,19.3 51.82,13.7 C11.1 | I2C.1 56.41,20.57 55.58,21.4 | R19.2 R18.2 | C12.1 55.76,12.69 SERIAL_CLOCK.1 | C2.1 37.24,31.49 U$7.P$5 36.26,32.7 36.01,32.96 34.81,31.75 34.81,28.7 | +5V.1 38.24,28.7 | 22.75,12.71 23.63,13.59 | 23.63,13.59 24.27,14.22 | C29.1 23.95,13.27 23.63,13.59 | v30.62,15.37 29.6,14.35 25.09,14.35
  Top 0.635: SERIAL_CLOCK.1 54.76,12.57 53.63,13.7 C11.1
  Bottom 0.254: v26.42,7.87 26.62,8.07 REF.4 | C13.1 43.3,27.18 | 30.01,33.01 U$2.16 | R23.2 30.62,16.58
  Bottom 0.508: 57.16,9.02 57.16,10.92 56.78,11.3 SERIAL_DATA.7 54.24,11.3 53.86,10.92 52.84,10.92 52.08,11.68 v52.08,13.59 | 57.16,9.02 56.9,8.76 | 56.9,8.76 SERIAL_DATA.5 | SERIAL_DATA.1 55.28,3.32 | 57.16,8.38 57.16,9.02 | 57.16,8.38 v57.16,4.95 57.16,4.15 56.7,3.7 | 56.9,8.76 56.9,8.64 57.16,8.38 | ROHM_I2C.7 ROHM_I2C.8 44.01,28.89 43.3,28.18 43.3,27.18 43.06,26.94 v43.06,25.4 | v51.88,19.36 52.19,19.67 C4.1 v53.48,22.73 53.48,23.24 52.97,23.75 49.41,23.75 48.97,24.19 v48.27,23.5 46.74,21.97 38.85,21.97 38.47,21.59 33.9,21.59 | v30.25,32.51 30.25,32.77 30.01,33.01 | 33.9,21.59 33.9,18.4 32.21,16.7 R23.2 | 30.62,16.58 v30.62,15.37 | 33.9,21.59 33.9,22.35 v33.66,22.59 33.86,22.79 C5.1
  Bottom 0.635: CONVERSION.6 55.56,19.92 53.73,19.92 C4.1 | 55.28,3.32 C10.1 | 56.7,3.7 55.66,3.7 SERIAL_DATA.1
+12V  (via drill 0.35)
  Top 0.254: C28.1 17.79,11.75 | 28.67,20.87 v28.71,20.83
  Top 0.508: C15.1 50.45,27.83 v49.69,28.6 49.2,29.08 +12V.1 42.44,34.66 C8.1 39.79,34.66 | U$7.P$3 39.79,34.66 | U$7.P$1 38.68,32.7 38.49,32.89 38.49,34.29 38.85,34.66 39.79,34.66 | 17.79,11.75 17.79,14.99 18,15.2 U$3.4 19.53,15.2 23.38,19.05 27.06,19.05 28.71,20.7 v28.71,20.83 | 28.67,20.87 U$11.4 29.62,21.95 31.76,19.81 36.2,19.81 36.97,20.57 v36.97,22.35
  Bottom 0.508: U$8.1 50.13,28.57 49.67,28.57 v49.69,28.6 | +12V.1 48.01,25.78 44.97,22.73 37.35,22.73 v36.97,22.35 | v28.71,20.83 28.52,21.02 C22.2
-12V  (via drill 0.35)
  Top 0.254: C28.2 16.07,11.94 | 15.84,13.25 16.07,13.02 16.07,13.14
  Top 0.508: -12V.1 49.78,35.43 v50.04,35.17 C20.2 | 16.07,13.02 16.07,11.94 | 15.84,13.25 U$3.8 | v27.31,27.69 27.37,27.63 U$11.7 27.37,25.27 27.62,25.02 | 16.07,13.14 16.9,13.97 16.9,15.24 17.66,16 19.31,16 27.62,24.31 27.62,25.02 | 27.62,25.02 27.75,25.15 v30.11,25.15
  Bottom 0.508: U$9.1 50.04,35.15 v50.04,35.17 | -12V.1 45.73,33.15 45.73,25.36 44.63,24.26 37.98,24.26 37.09,25.15 v30.11,25.15 | C25.1 26.62,26.99 v27.31,27.69
CLK+  (via drill 0.35)
  Top 0.254: v71.26,9.91 71.26,8.76 69.73,7.24 R6.2 69.35,7.43 67.69,7.43 R9.2 66.94,7.69 65.21,7.69 SERIAL_CLOCK.12 | CLK+.TP 74.05,18.8 v78.11,18.8
  Bottom 0.254: v71.26,9.91 71.26,10.29 79,18.03 79,18.8 | RJ45.1 82.5,19.91 79.36,19.91 79,19.56 79,18.8 | v78.11,18.8 79,18.8
CLK-  (via drill 0.35)
  Top 0.254: v71.13,11.05 71.13,10.61 R7.1 69.22,8.7 67.83,8.7 R9.1 67,8.64 65.15,8.64 SERIAL_CLOCK.13 | RJ45.2 81.77,20.7 CLK-.TP
  Bottom 0.254: v71.13,11.05 77.35,17.27 77.35,19.68 78.63,20.96 RJ45.2
CLK_DIR  (via drill 0.35)
  Top 0.254: SERIAL_CLOCK.4 55.39,8.51 51.95,8.51 51.06,9.4 51.06,16.28 50.45,16.89 50.45,22.84 43.32,29.97 36.84,29.97 36.08,30.73 v36.08,30.86
  Bottom 0.254: U$2.4 35.88,31.06 v36.08,30.86
CONV  (via drill 0.35)
  Top 0.254: RJ45.5 83.43,16.76 83.43,14.72 81.8,13.08 76.59,13.08 CONV1.TP 74.93,12.19 72.14,14.97 72.14,17.27 70.75,18.67 v67.83,18.67
  Bottom 0.254: v67.83,18.67 CONVERSION.2
CONV_ADC  (via drill 0.35)
  Top 0.254: U$1.2 41.4,12.71 v41.6,12.51 | CONV_TP.TP 45.86,19.81 CONV.1
  Bottom 0.254: v41.6,12.51 41.6,16.32 45.47,20.19 CONV.1
DATA+
  Top 0.254: D+.TP 74.44,16.89 RJ45.6
  Bottom 0.254: SERIAL_DATA.12 67.13,8.76 R15.2 69.6,9.08 R16.2 69.99,8.96 71.19,8.96 79.12,16.89 RJ45.6
DATA-  (via drill 0.35)
  Top 0.254: D-.TP 74.81,14.86 78.11,14.86 v78.08,14.89
  Bottom 0.254: SERIAL_DATA.13 65.08,7.43 67.19,7.43 R15.1 67.58,7.05 R17.1 70.24,7.05 v78.08,14.89 79.09,15.9 82.56,15.9 83.43,16.77 83.43,18.8 RJ45.3
DATA_DIR  (via drill 0.35)
  Top 0.254: v53.99,7.49 52.33,7.49 50.66,9.17 50.66,16.11 50.05,16.72 50.05,22.55 43.13,29.46 v36.2,29.46
  Bottom 0.254: SERIAL_DATA.4 v53.99,7.49 | v36.2,29.46 36.2,29.9 35.7,30.41 U$2.5
DGND  (via drill 0.35)
  Top 0.254: C51.2 29.6,10.23 | C1.2 29.66,7.11 | C11.2 53.62,11.3 | POWER1.C 29.48,17.28 v29.28,17.08 | v33.39,32.51 33.39,35.42 GND5.TP | U$11.3 27.69,21.95 U$11.2 | STATUS.C 39.97,17.28 | 35.13,20.63 v35.19,20.57 | 35.19,17.41 35.06,17.28 | TP4.TP 7.96,9.02 U$6.P$1 | C15.2 51.44,29.83 51.57,29.7 | U$1.10 21.01,10.97 v20.58,10.54
  Top 0.508: 53.62,11.3 SERIAL_CLOCK.2 | SERIAL_CLOCK.5 SERIAL_CLOCK.6 54.49,6.22 53.53,5.26 C10.2 | 29.6,10.23 v29.6,11.18 | v30.87,7.11 29.66,7.11 | v52.52,22.92 52.08,23.37 52.08,25.78 | v51.06,20.07 v51.06,17.78 | v33.39,32.51 33.39,31.88 C14.2 | v50.94,8 50.94,6.97 52.59,5.32 C10.2 | v51.72,9.55 53.22,11.05 C11.2 | DC-DC_CONVERTER.6 52.59,29.7 | 51.57,29.7 52.59,29.7 | I2C.4 55.87,16.76 C12.2 55.14,16.88 v54.62,17.4 | C20.1 C15.2 | C20.1 48.13,32.27 GND_4.1 | 52.08,25.78 52.08,26.7 52.39,27.01 52.39,29.51 52.59,29.7 | C19.1 53.48,33.66 52.08,32.26 50.95,32.26 C20.1 | C18.2 52.08,25.78 | U$7.P$2 40.52,33.66 40.57,33.6 40.59,33.6 C8.2 v40.45,31.57 40.12,31.24 C2.2 | v20.58,10.54 C29.2 | 27.69,21.95 v27.69,20.83 | U$4.4 U$4.3 | U$4.3 U$4.2 34.48,22.99 | 34.48,22.99 U$4.7 | 34.48,22.99 35.57,22.99 v35.95,22.61 | 39.97,17.28 35.06,17.28 29.48,17.28 | U$4.3 35.13,20.63 | v35.19,19.05 35.19,17.41 | SERIAL_CLOCK.8 54.31,3.68 53.49,4.51 53.49,5.3 C10.2
  Bottom 0.254: 29.61,11.16 v29.6,11.18 29.28,11.49 | v51.06,17.78 51.17,17.67 | U$2.1 34.73,32.38 | 33.52,32.38 v33.39,32.51 | C22.1 26.62,21.91 | 28.52,25.33 C25.2 28.9,26.04 | TP4.TP 7.96,9.02 U$6.P$1
  Bottom 0.508: SERIAL_DATA.2 55.28,5.32 C10.2 | CONVERSION.4 54.38,16.2 54.38,13.84 SERIAL_DATA.8 54.09,12.57 C11.2 | 29.61,11.16 REF.1 REF.2 29.98,9.02 30.87,8.13 v30.87,7.11 | C13.2 41.3,28.18 40.58,28.89 ROHM_I2C.1 | ROHM_I2C.1 ROHM_I2C.2 ROHM_I2C.3 | ROHM_I2C.3 ROHM_I2C.4 38.37,33.01 U$2.1 U$2.2 U$2.3 | C4.2 51.17,17.67 | ROHM_I2C.1 38.36,28.89 37.89,28.42 37.84,28.46 U$2.8 34.73,27.99 32.77,26.04 28.9,26.04 | v51.06,20.07 51.06,21.46 v52.52,22.92 | v50.94,8 50.94,8.76 v51.72,9.55 | 34.73,32.38 33.52,32.38 | GND_4.1 48.01,31.62 46.49,30.1 46.49,25.19 44.8,23.5 36.01,23.5 C5.2 35.76,22.8 v35.95,22.61 | v29.6,11.18 21.22,11.18 | 21.22,11.18 v20.58,10.54 | 29.28,11.49 v29.28,17.08 27.69,18.67 v27.69,20.83 26.62,21.91 | U$6.P$1 7.98,13.18 11.69,16.89 R5.2 15.95,16.13 15.31,15.49 15.31,14.41 16.01,13.72 18.68,13.72 21.22,11.18 | 26.62,23.43 26.62,23.5 R3.2 | 26.62,23.43 C22.1 | 28.52,25.33 26.62,23.43 | v35.19,20.57 v35.19,19.05 | ROHM_I2C.3 40.33,31.43 40.52,31.62 40.51,31.62 v40.45,31.57
  Bottom 0.635: CONVERSION.4 v54.62,17.4 53.75,17.4 C4.2
  other vias: 53.22,11.7 53.48,5.32 11.06,25.91 18.42,22.48 6.36,23.75 10.42,19.18
  pour Top: -3.29,39.88 55.38,39.88 55.63,39.62 55.63,-0.89 53.73,-2.79 -1.01,-2.79 -3.55,-0.25 -3.55,39.62
  pour Bottom: -0.25,41.4 1.41,39.75 48.9,39.75 55,39.75 55.38,39.37 55.51,39.24 55.63,39.12 55.63,-1.27 55.13,-1.78 -6.98,-1.78 -8.25,-0.51 -8.25,33.4
INPUT_ZERO  (via drill 0.35)
  Top 0.254: v28.08,27.69 28.02,27.63 U$11.6
  Bottom 0.254: U$2.9 28.79,28.4 v28.08,27.69
N$1
  Top 0.254: C27.2 21.98,15.55 21.98,14.1 21.59,13.71 U$1.7 20.24,13.71 20.05,13.9 U$3.2
N$2  (via drill 0.35)
  Top 0.254: v30.23,30.1 31.06,29.27 R1.2
  Bottom 0.254: U$2.13 29.66,31.06 30.23,30.48 v30.23,30.1
N$3
  Top 0.254: SERIAL_CLOCK.10 65.65,5.59 67.95,5.59 68.08,5.46 68.08,4.19 DE_CLK.1
N$4
  Bottom 0.254: SDA.2 48.4,13.84 52.84,9.4 55.01,9.4 SERIAL_DATA.6
N$5
  Top 0.254: U$1.6 20.34,14.21 20,14.55 U$3.3
N$6  (via drill 0.35)
  Top 0.508: DC-DC_CONVERTER.5 55.62,31.86 C19.2 55.62,34.18 v54.49,35.31
  Bottom 0.508: U$9.2 55.8,33.99 | 55.8,33.99 55.7,34.1 v54.49,35.31 | C24.2 58.05,31.75 55.8,33.99
N$7  (via drill 0.35)
  Top 0.254: DE_DATA.1 68.08,14.1 v67.83,14.35
  Bottom 0.254: SERIAL_DATA.10 65.65,10.67 67.24,10.67 67.83,11.25 v67.83,14.35
N$9  (via drill 0.35)
  Top 0.254: C27.1 24.07,15.05 22.23,13.21 U$1.8 19.95,13.21 | 19.95,13.21 18.8,13.21 v18.8,12.57 | U$3.1 19.91,13.25 19.95,13.21 | v14.49,15.75 14.52,15.71 U$3.5
  Bottom 0.254: v18.8,12.57 16.01,12.57 14.49,14.1 v14.49,15.75
N$10  (via drill 0.35)
  Top 0.254: L1.1
  Top 0.508: DC-DC_CONVERTER.1 67.4,31.7 L1.1
  other vias: 67.69,32
N$11
  Bottom 0.61: ON/OFF.3 76.59,29.78 R2.2
N$12
  Top 0.254: ON/OFF.2 74.05,30.78 68.97,25.7 DC-DC_CONVERTER.4
N$13
  Top 0.254: R12.1 33.43,21.91 U$4.1
N$14  (via drill 0.35)
  Top 0.254: v42.93,32.7 43.57,32.07 43.57,31.05 51.44,23.18 51.44,22.73 51.95,22.23 51.95,20.88 52.36,20.47 54.41,20.47 R19.1 55.57,19.5 55.76,19.3 I2C.2 | U$4.6 35.13,24.57 34.81,24.89 32.14,24.89 26.81,30.23 v26.81,32.64
  Bottom 0.254: 27.44,32.58 27.44,34.16 28.08,34.8 40.65,34.8 42.74,32.7 v42.93,32.7 ROHM_I2C.5 | 27.44,32.58 27.66,32.36 U$2.15 | v26.81,32.64 27.38,32.64 27.44,32.58
N$15  (via drill 0.35)
  Top 0.254: U$3.6 15.7,14.55 15.85,14.7 v16.1,14.7
  Bottom 0.254: R4.2 19.06,18.1 R5.1 17.85,16.44 v16.1,14.7
N$16
  Top 0.254: R11.2 19.06,25.65 19.82,24.89 23.88,24.89 25.3,26.3 U$11.8
  Bottom 0.254: R11.2 19.06,24.13 19.69,23.5 R3.1
N$17  (via drill 0.35)
  Top 0.254: I2C.3 53.86,18.03 53.22,18.67 R18.1 52.55,19.5 52.11,19.93 52.01,19.93 51.55,20.4 51.55,21.29 50.98,21.85 50.98,23.07 42.93,31.11 v42.93,31.75 | v27.38,31.62 27.38,30.28 32.27,25.4 35.57,25.4 35.82,25.15 35.82,24 U$4.5
  Bottom 0.254: ROHM_I2C.6 43.25,31.43 v42.93,31.75 40.9,33.78 31.38,33.78 30.97,33.37 30.97,32.03 30.65,31.71 U$2.14 28.7,31.62 v27.38,31.62
N$18
  Top 0.254: R12.2 27.88,23.81 26.68,22.61 26.68,22 U$11.1
N$19  (via drill 0.35)
  Top 0.508: v54.87,24.38 55.75,25.26 C18.1 55.75,27.42 DC-DC_CONVERTER.7
  Bottom 0.508: U$8.2 55.68,25.19 v54.87,24.38
N$22
  Top 0.254: STATUS.A 40.14,20.95 36.33,24.77 36.33,25.78 35.63,26.48 R8.1
N$24
  Bottom 0.254: CONVERSION.5 51.22,18.67 49.69,20.19 CONV.2
N$26  (via drill 0.35)
  Top 0.254: U$1.3 42.17,13.21 v42.3,13.08 | SCK.1 45.35,17.14 SCK_TP.TP
  Bottom 0.254: SCK.1 43.57,17.14 42.3,15.88 v42.3,13.08
N$27  (via drill 0.35)
  Top 0.254: POWER1.A 29.85,19.93 v30.49,19.93
  Bottom 0.254: v30.49,19.93 R23.1
N$32  (via drill 0.35)
  other vias: 73.54,5.08
N$53  (via drill 0.35)
  Top 0.254: POWER.A 73.8,26.29 v73.41,25.91
  Bottom 0.254: v73.41,25.91 R21.1
REF_  (via drill 0.35)
  Top 0.254: C51.1 27.25,10.03 v26.42,10.03 26.42,11.02 U$1.1
  Bottom 0.254: REF.6 26.49,9.97 | 26.49,9.97 v26.42,10.03 | REF_2.5.1 25.79,6.73 25.79,9.27 26.49,9.97
SCK_ADC  (via drill 0.35)
  Top 0.254: SERIAL_CLOCK.3 53.73,10.03 v53.6,10.16
  Bottom 0.254: v53.6,10.16 52.69,10.16 50.05,12.81 50.05,15.49 SCK.2
SCL
  Top 0.254: RJ45.7 84.58,14.46 82.56,12.45 77.61,12.45 76.34,11.18 74.94,11.18 71.74,14.37 71.74,16.91 70.62,18.03 67.45,18.03 | 67.45,18.03 I2C.6 | R22.1 67.45,16.7 67.45,18.03
SDO
  Top 0.254: RJ45.8 81.16,13.97 73.9,13.97 72.63,15.24 72.63,17.74 69.99,20.39 R20.1 68.01,19.3 I2C.7
SDO_ADC
  Top 0.254: U$1.4 45.59,13.71 SDA.1 44.33,12.45 SDA_TP.TP
STATUS_LED  (via drill 0.35)
  Top 0.254: R8.2 33.03,26.67 v32.14,27.56
  Bottom 0.254: v32.14,27.56 32.14,28.45 33.45,29.76 U$2.6
V+  (via drill 0.35)
  Top 0.254: R20.2 68.52,22.29 67.06,20.83 v67.06,19.94 | R22.2 69.41,15.94 68.72,15.24 67.57,15.24 67.06,14.73 67.06,13.32 C7.1
  Top 0.508: 65.04,12.56 67.06,12.56 C7.1 67.8,12.59 69.08,12.59 v69.1,12.57 71.26,12.57 74.05,9.78 v74.05,8.64 | RJ45.4 83.31,20.2 83.31,21.46 82.04,22.73 VCC.1 72.53,24 v72.53,27.94 | I2C.8 63.05,20.7 67.06,20.7 | C6.1 67.06,20.7 | 67.06,20.7 v67.06,19.94
  Top 0.635: v69.73,3.3 R6.1 | SERIAL_CLOCK.16 65.04,12.56
  Bottom 0.254: VCC.1 74.94,23.88 75.51,23.88 76.4,24.77 R21.2
  Bottom 0.508: SERIAL_DATA.16 67.08,3.68 C9.1 69.73,3.32 | R16.1 69.1,11.74 v69.1,12.57 68.72,12.95 68.72,15.76 C3.1 69.97,16.13 73.8,19.95 VCC.1 69.86,22.73 v67.06,19.94 CONVERSION.1 | L1.2 69.99,28.57 | 70.62,27.94 v72.53,27.94 73.67,29.08 R2.1 | v74.05,8.64 74.05,7.11 70.24,3.3 v69.73,3.3
  Bottom 0.61: C23.2 70.62,27.94
  Bottom 0.635: 69.99,28.57 C23.2 | 69.73,3.32 v69.73,3.3
V_OUT
  Top 0.254: U$3.7 13.41,13.9 | R11.1 21.6,26.67 20.27,28 U$5.P$1 3.12,28
  Top 0.508: 13.41,13.9 13.22,14.1 13.22,17.02 | 13.22,17.02 13.22,18.16 7.98,23.4 U$5.P$1 | R4.3 16.52,19.3 14.23,17.02 13.22,17.02
  Top 1.27: TP1.TP 3.12,28
  Bottom 0.254: TP1.TP 7.92,27.94 U$5.P$1

### Text on the board
tNames: GND | GND | GND | 0V | TDN3 1222 WISM | 0V | OL | ST | PWR | 0V | 0V | GND | 0V | 2023_08_15 | GND | GND | DINOdac V0.1 | M. Pitz; N. Eiling
bNames: PLUS | MINUS
bReserve: ROHM_I2C